# Altium schematic sheet Flash.SchDoc
size A3
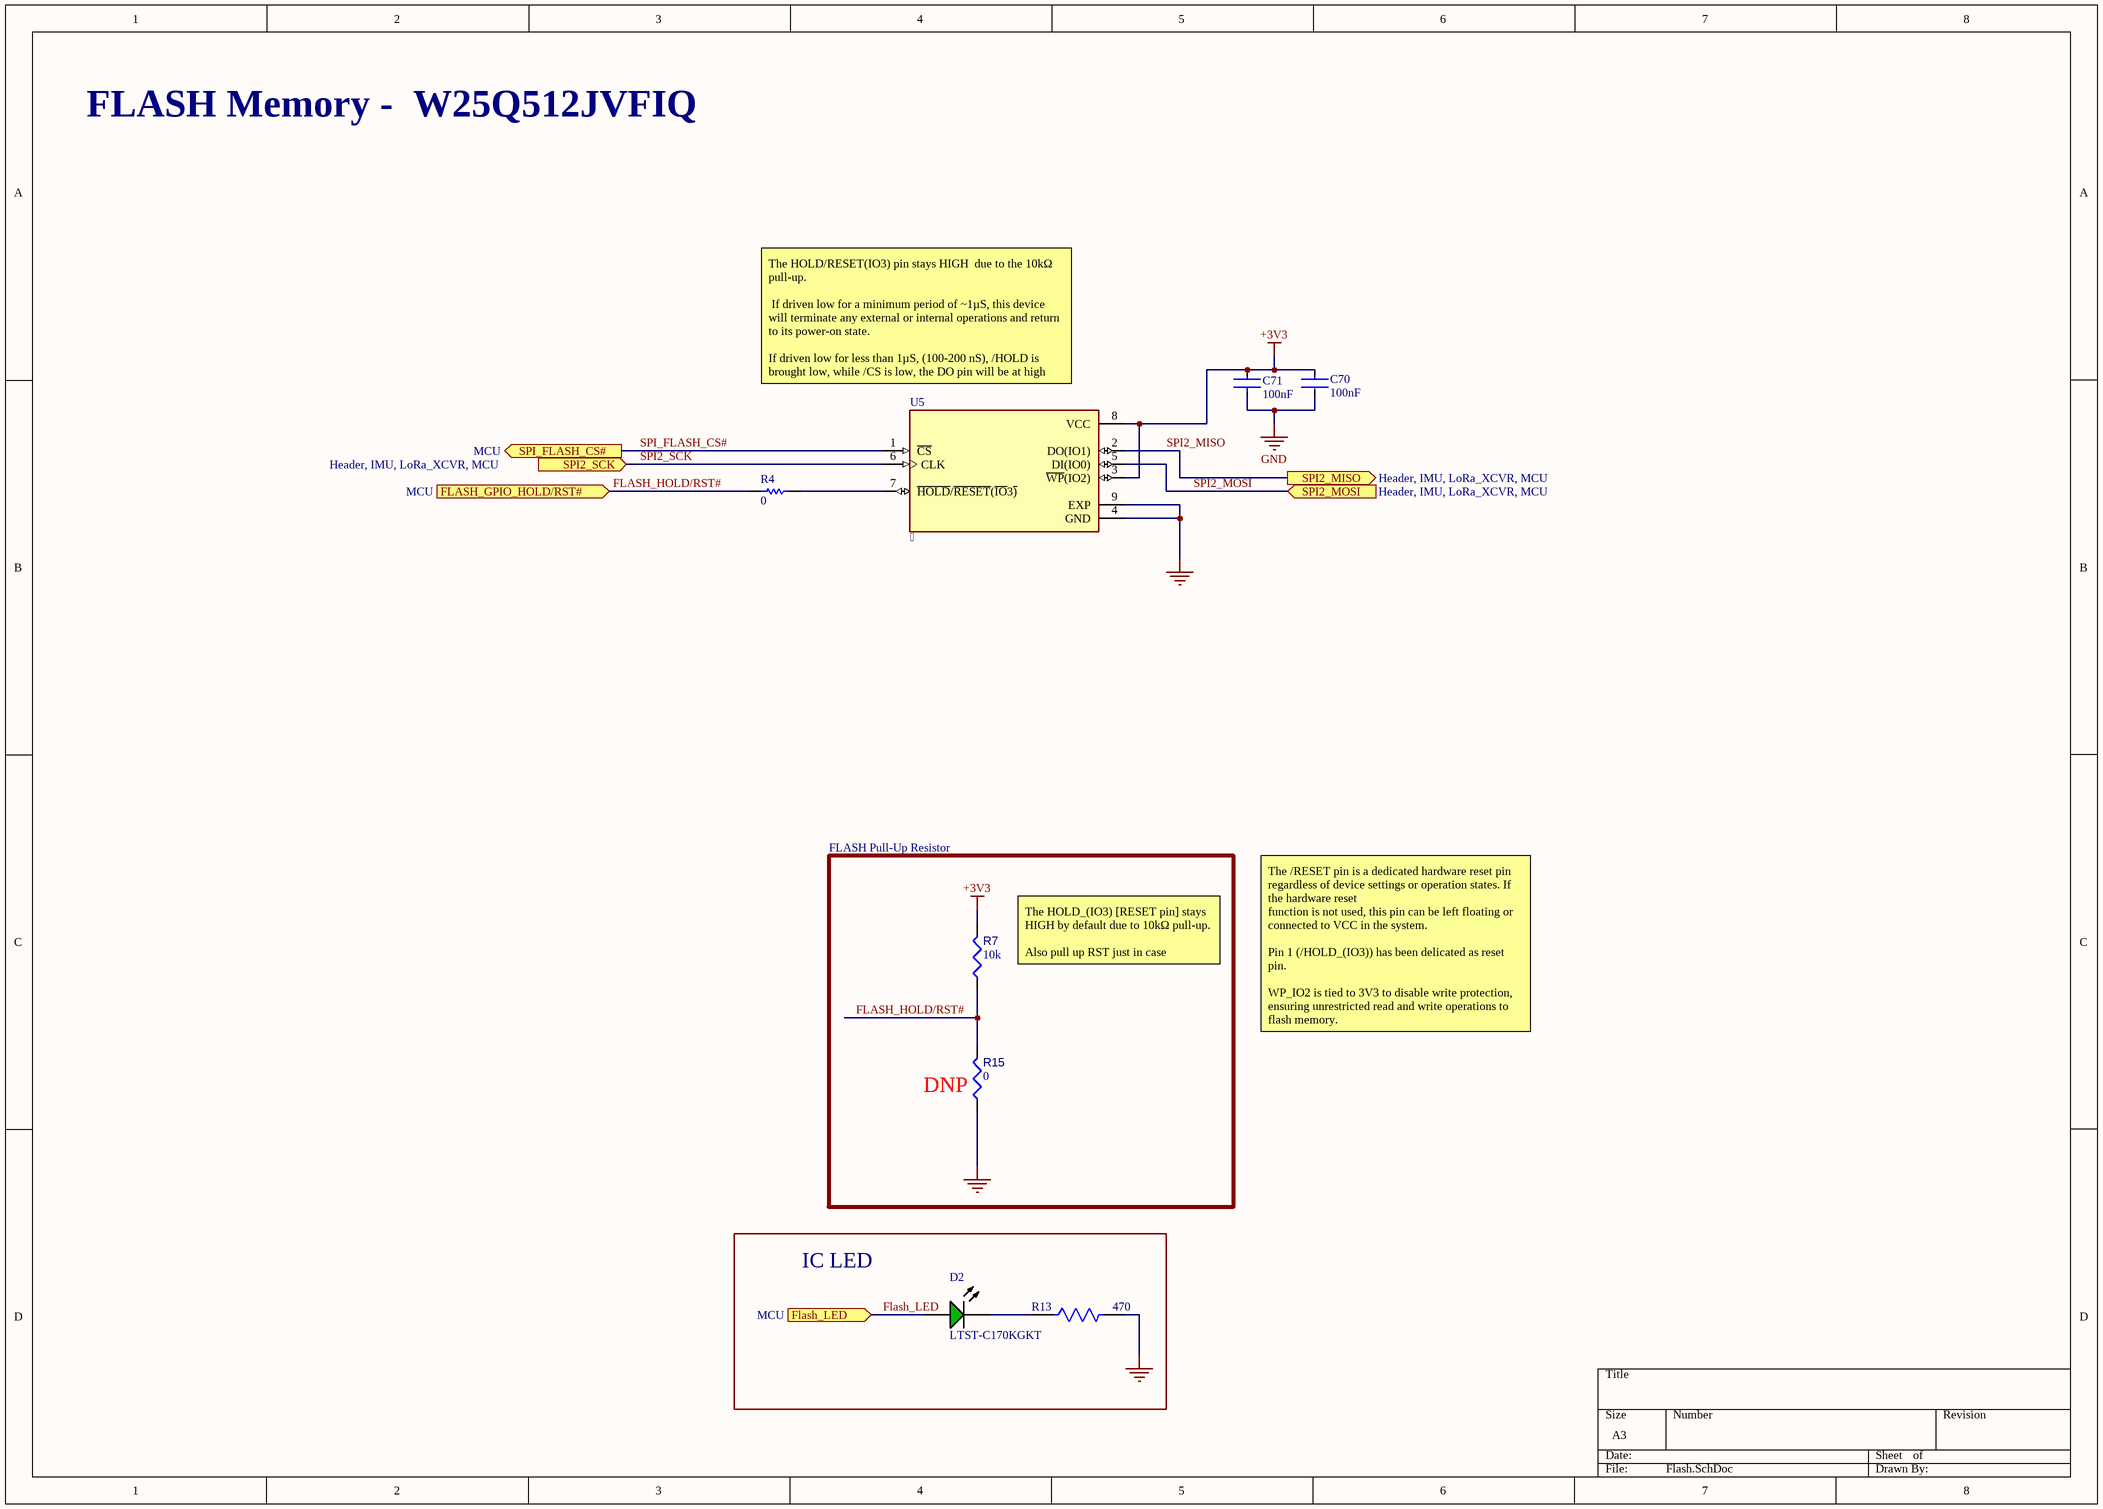
[diagram p0: Flash.SchDoc]

## Parts
C70  100nF  [FP-GRM15-MFG]
C71  100nF  [FP-GRM15-MFG]
D2  LTST-C170KGKT  [LTST-LTST-C170KGKT-2_V]
R4  0  [RESC1005X40X25LL05T05]
R7  value 10k  [RESC1005X40X25ML05T05]  (hidden comment: Resistor 10k +/-1% 0402 100 mW)
R13  470  [FP-CPF0603-MFG]
R15  value 0  [RESC1005X40X25ML05T05]  (hidden comment: Resistor 10k +/-1% 0402 100 mW)  (no BOM)
U5    [SON127P600X800X80-9N]

## Blocks framed on the sheet
DNP: R7 R15
IC LED: D2 R13

## Ports
FLASH_GPIO_HOLD/RST# (in, see MCU), Flash_LED (in, see MCU), SPI2_MISO (out, see Header, IMU, LoRa_XCVR, MCU), SPI2_MOSI (in, see Header, IMU, LoRa_XCVR, MCU), SPI2_SCK (in, see Header, IMU, LoRa_XCVR, MCU), SPI_FLASH_CS# (out, see MCU)

## Nets
+3V3: C70.2 C71.1 R7.2 U5.3(~{WP}(IO2)) U5.8(VCC)
GND: C70.1 C71.2 R13.2 R15.1 U5.4(GND) U5.9(EXP)
FLASH_HOLD/RST#: R4.1 R7.1 R15.2 ; port FLASH_GPIO_HOLD/RST#
Flash_LED: D2.2(A) ; port Flash_LED
SPI2_MISO: U5.2(DO(IO1)) ; port SPI2_MISO
SPI2_MOSI: U5.5(DI(IO0)) ; port SPI2_MOSI
SPI2_SCK: U5.6(CLK) ; port SPI2_SCK
SPI_FLASH_CS#: U5.1(~{CS}) ; port SPI_FLASH_CS#
NetD2_1: D2.1(K) R13.1
NetR4_2: R4.2 U5.7(~{HOLD}/~{RESET}(~{IO}3~{)})

## Notes on the sheet
- FLASH Memory -  W25Q512JVFIQ
- (near U5) The HOLD/RESET(IO3) pin stays HIGH  due to the 10kΩ pull-up.
  If driven low for a minimum period of ~1µS, this device will terminate any external or internal operations and return to its power-on state.
  If driven low for less than 1µS, (100-200 nS), /HOLD is brought low, while /CS is low, the DO pin will be at high impedance and signals on the DI and CLK pins will be ignored.
- FLASH Pull-Up Resistor
- (near R7) The HOLD_(IO3) [RESET pin] stays HIGH by default due to 10kΩ pull-up.
  Also pull up RST just in case
- The /RESET pin is a dedicated hardware reset pin regardless of device settings or operation states. If the hardware reset
  function is not used, this pin can be left floating or connected to VCC in the system.
  Pin 1 (/HOLD_(IO3)) has been delicated as reset pin.
  WP_IO2 is tied to 3V3 to disable write protection, ensuring unrestricted read and write operations to flash memory.

## Library data of the parts
C70 C71 = CMP-2100-03641-2: CAP CER 0.1UF 16V X7R 0402; Manufacturer Part Number: GRM155R71C104KA88D; Manufacturer: Murata; Standoff Height: 0mm; Tolerance: 10%; Voltage Rating: 16Vdc; Material: Ceramic; Capacitance: 0.10μF; Value: 0.10μF; RoHS: TRUE; Temperature Characteristic: X7R; Octopart: https://octopart.com/grm155r71c104ka88d-murata-196880; Digikey Description: CAP CER 0.1UF 16V X7R 0402; Device Class L3: Ceramic Capacitors; Height: 0.55mm; ComponentLink2Description: Datasheet; Temperature Range Low: -55°C; Ipc Land Pattern Name: CAPC10050X219; ComponentLink2URL: https://search.murata.co.jp/Ceramy/image/img/A01X/G101/ENG/GRM155R71H471KA01-01A.pdf; Device Class L1: Passive Components; Lead Free: yes; Category: Cap; Package: GRM15; Temperature: -55°C to +125°C; Device Class L2: Capacitors; Temperature Range High: +125°C; Mouser Description: 0402 0.1 uF 16V ±10 % Tolerance X7R SMT Multilayer Ceramic Capacitor
D2 = CMP-2000-06620-1: Ultra Bright AlInGaP Chip LED, 75 mW, -55 to 85 degC, 2-Pin SMD (0805), RoHS, Tape and Reel; Manufacturer: Lite-On; Forward Current: 30mA; Power Dissipation Max: 75mW; Emitting Color: YellowGreen; Type: Uni-Color; Forward Voltage: 2.4V; Dominant Wave Length: 571nm; Test Current (It): 20mA; Product Length (mm): 2mm; Peak Wavelength: 574nm; Power Dissipation: 75W; Product Depth (mm): 1.25mm; DELETED: Compliant; High Brightness: Yes; Product Height (mm): 1.1mm; Luminous Intensity: 35mcd; Shape Type: Rectangular; Chip Material: AlGaInP; Viewing Angle: 130deg; Number of  Elements: 1; Reverse Voltage: 5V; Rad Hardened: No; Package Type: ChipLed; Manufacturer URL: http://www.us.liteon.com/; Mounting: SurfaceMount; Operating Temp Range: -55Cto85C; Datasheet URL: http://optoelectronics.liteon.com/upload/download/DS22-2000-073/S_110_LTST-C170KGKT.pdf; Packaging: TapeandReel; Pin Count: 2; Package Description: 2-Pin Surface Mounted Device, Body 2 x 1.25 mm; Mounting Technology: SurfaceMount; Package Reference: LTST-C170KGKT-2; Forward Current Max: 30mA; Datasheet Version: Rev. G, 06/2005; Lens Dimensions: 1.4x1.25x0.6mm; Operating Temperature Classification: Industrial; Lum Intensity: 35mcd; Main Category: ChipLED
R4 = CMP-2000-07451-1: Chip Resistor, 0 Ohm, 0.1 W, -55 to 155 degC, 0402 (1005 Metric), RoHS, Tape and Reel; Manufacturer: Panasonic; Voltage Rating (DC): 50V; Temperature Coefficient: 600ppm/��C; Max Power Dissipation: 100mW; Resistance: 0mOhm; Tolerance: 5%; Number of Terminations: 2; Mount: SurfaceMount; Height: 0.35mm; Packaging: TapeandReel; Contact Plating: Tin; Manufacturer URL: http://www.panasonic.com/; Composition: ThickFilm; Max Operating Temperature: 155degC; REACH SVHC: NoSVHC; Case/Package: 0402; Package Reference: 402; Depth: 0.5mm; Package Description: 2-Pin Surface Mount Device, Body 1 x 0.5 mm; Datasheet URL: https://industrial.panasonic.com/cdbs/www-data/pdf/RDA0000/AOA0000C301.pdf; RoHSCompliant: True; Case Code (Imperial): 0402; Military Standard: Not; Min Operating Temperature: -55degC; Power Rating: 100mW; Datasheet Version: 03/2015; Length: 1mm; Case Code (Metric): 1005; Termination: SMD/SMT; Mounting Technology: SurfaceMount; Voltage Rating: 50V; Width: 0.02inch; Package Quantity: 1; Lead Free: LeadFree; Radiation Hardening: No
R7 R15 = CMP-009-00015-5: Chip Resistor, 10 KOhm, +/- 1%, 0.1 W, -55 to 155 degC, 0402 (1005 Metric); Voltage Rating: 50V; Power: 100mW; Case/Package: 0402; RoHS Compliant: True; Min Operating Temperature: -55°C; Mounting Technology: SM; Tolerance: 1%; Max Operating Temperature: 155°C; Pins: 2
R13 = CMP-03211-004765-1: RES SMD 470Ω 0.1% 1/16W 0603 / CPF0603B470RE; Manufacturer: TE Connectivity; Temperature Coefficient: 25ppm/°C; Voltage Rating: 50V; Power Rating: 0.063W; Value: 470Ω; Device Class L3: Chip SMD Resistors; RoHS: TRUE; Category: Res; Device Class L2: Resistors; Series: CPF; Height: 0.55mm; Temperature: -55°C to +155°C; Temperature Range High: +155°C; Automotive: No; octopart_url: https://octopart.com/cpf0603b470re-te+connectivity-23376607; packaging: 5k Reel; ComponentLink2Description: Datasheet; Temperature Range Low: -55°C; Device Class L1: Passive Components; Ipc Land Pattern Name: RESC15580X45; Package: CPF0603; Composition: Thin Film; Manufacturer Part Number: CPF0603B470RE; Resistance: 470Ω; Octopart: https://octopart.com/cpf0603b470re-te+connectivity-23376607; Lead Free: Yes; ComponentLink2URL: https://www.te.com/commerce/DocumentDelivery/DDEController?Action=showdoc&DocId=Data+Sheet%7F1773200%7FM%7Fpdf%7FEnglish%7FENG_DS_1773200_M.pdf%7F3-1676481-2; Tolerance: 0.1%
U5 = CMP-031-00007-1: FLASH - NOR Memory IC 512Mb (64M x 8) SPI - Quad I/O 133 MHz 8-WSON (8x6); MF: Winbond Electronics; Source: W25Q512JVEIQ.SchLib; Component Type: Standard; Design Item ID: W25Q512JVEIQ; SnapEDA_Link: https://www.snapeda.com/parts/W25Q512JVEIQ/Winbond/view-part/?ref=snap; MP: W25Q512JVEIQ; Case/Package: Package; Check_prices: https://www.snapeda.com/parts/W25Q512JVEIQ/Winbond/view-part/?ref=eda; Pins: 9; Value: *